# Altium project RK3588底板.PrjPcb (part 2 of 2)

## Sheet 9.PCIE3.SchDoc
size 420 x 297 mm; SheetNumber: 9; SheetTotal: 13
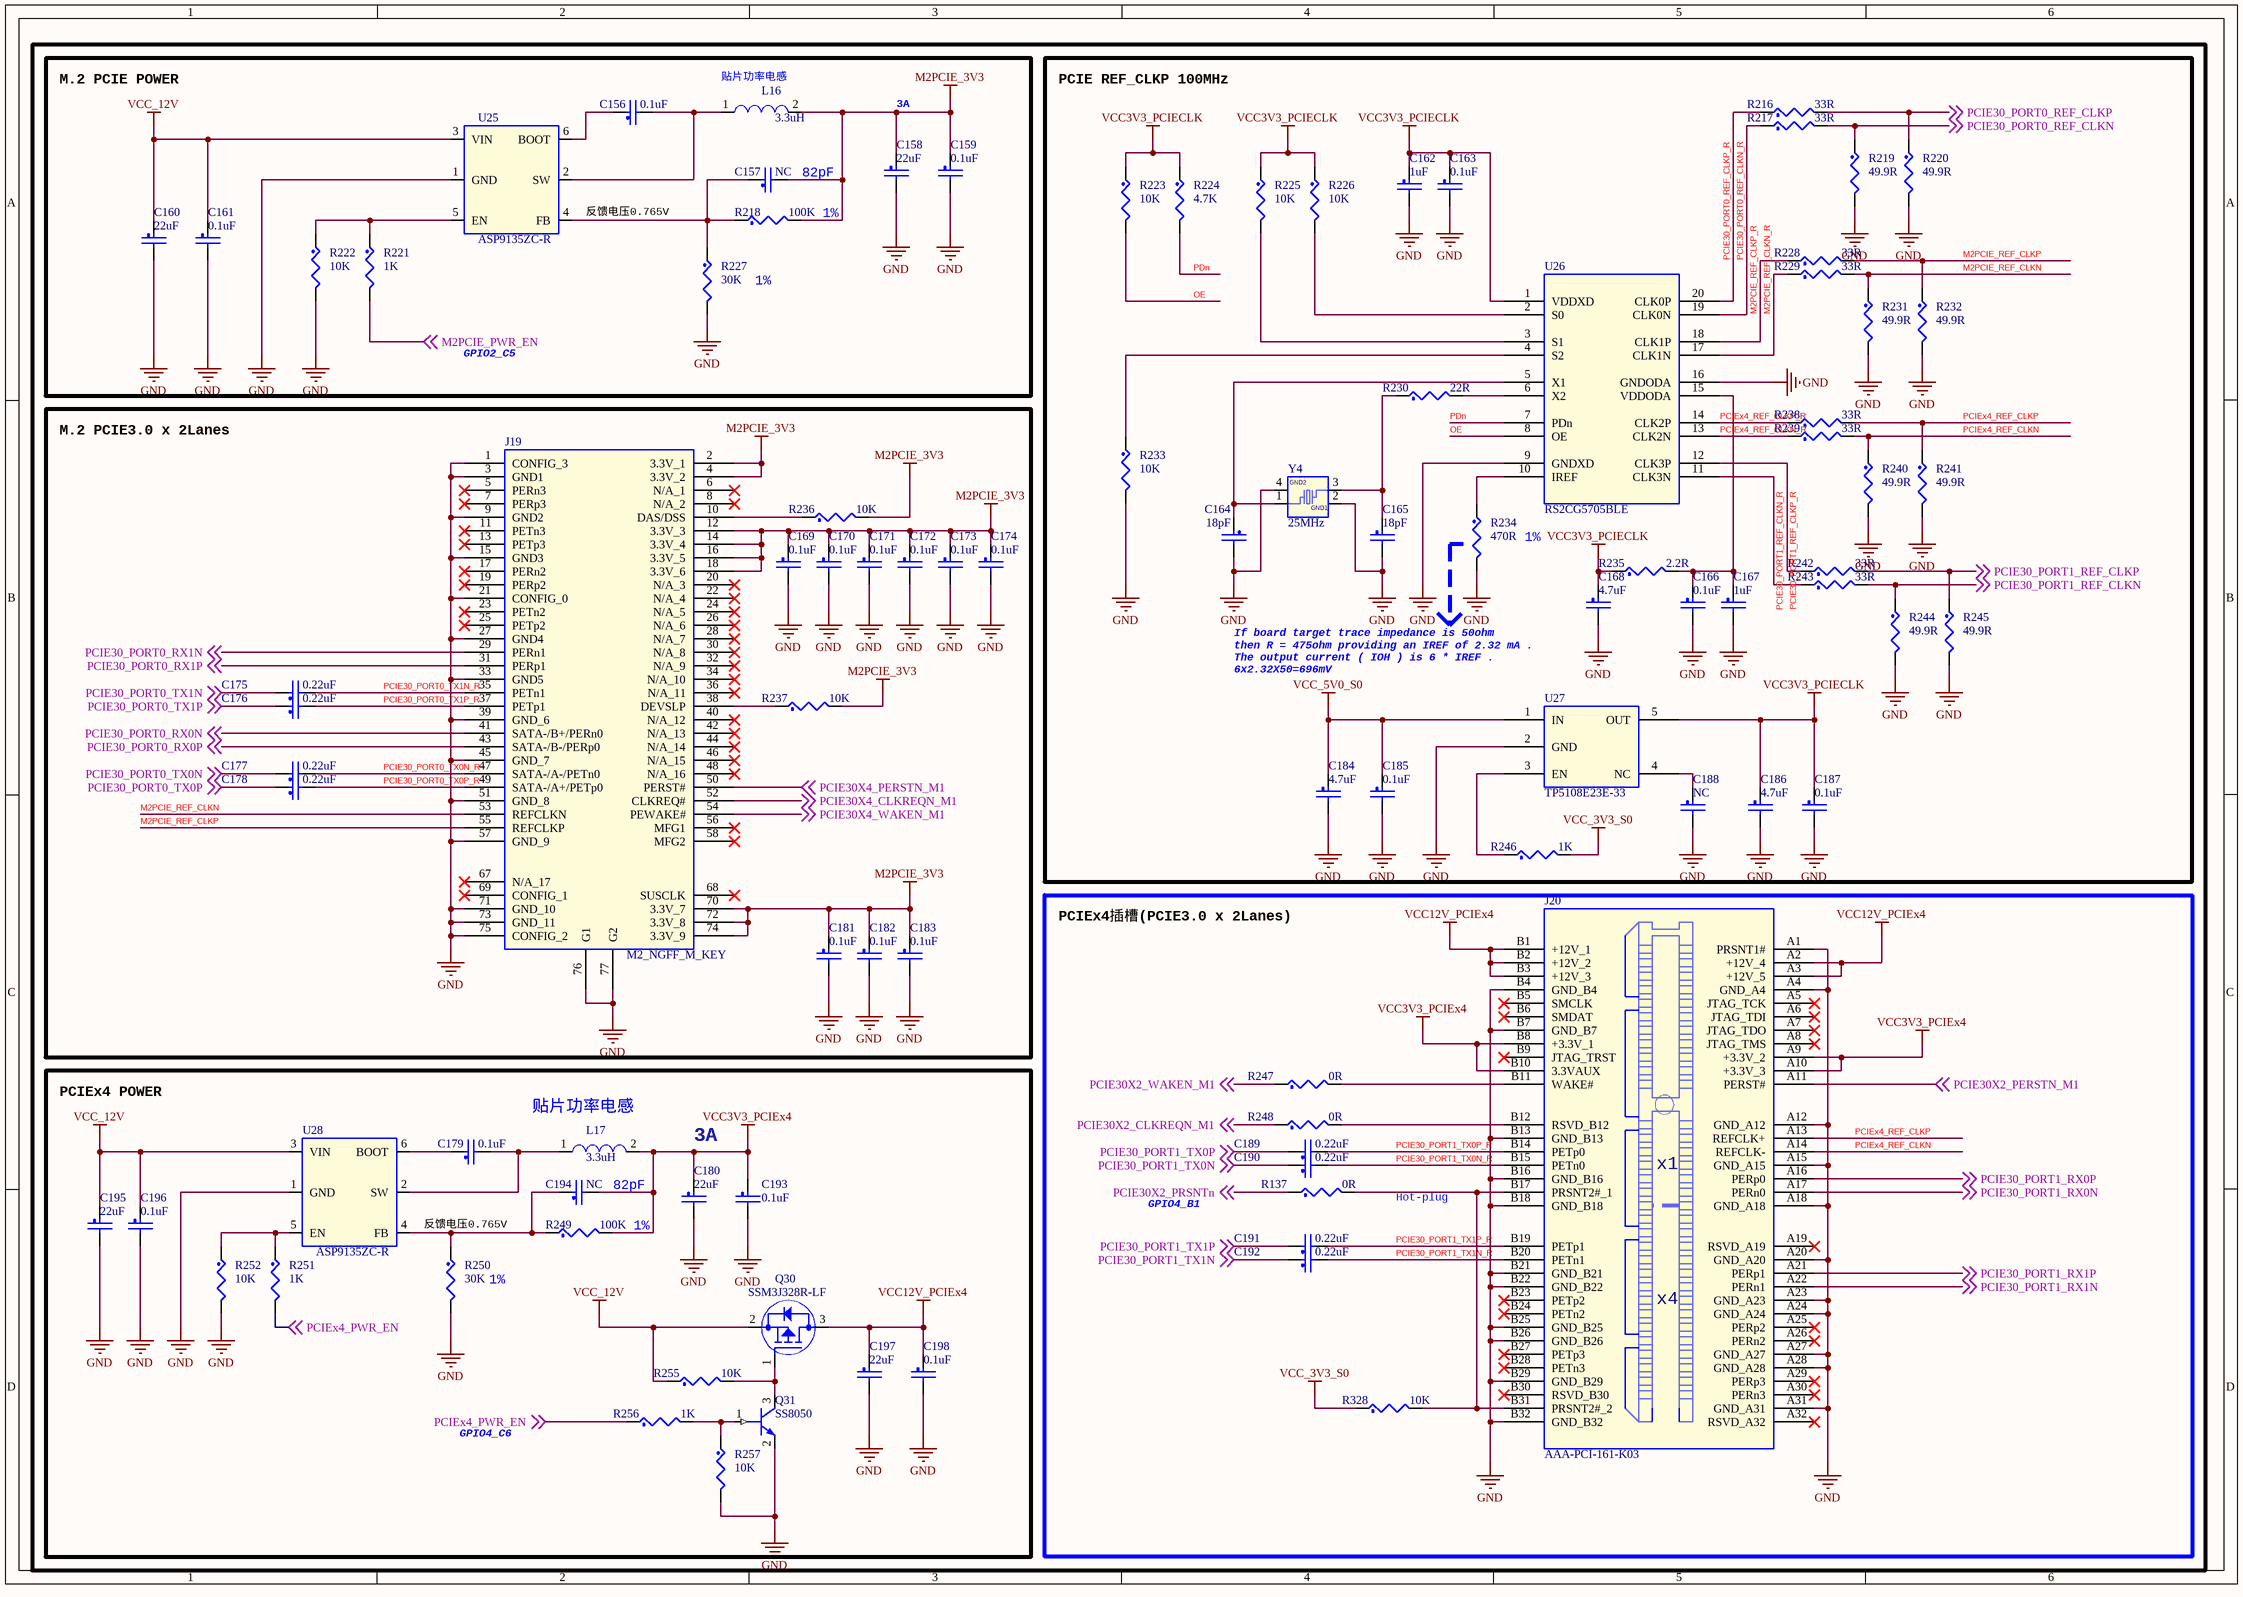
[diagram p8: 9.PCIE3.SchDoc]

### Parts
C156  0.1uF  [C0402]
C157  NC  [C0402]
C158  22uF  [C0603]
C159  0.1uF  [C0402]
C160  22uF  [C0603]
C161  0.1uF  [C0402]
C162  1uF  [C0402]
C163  0.1uF  [C0402]
C164  18pF  [C0402]
C165  18pF  [C0402]
C166  0.1uF  [C0402]
C167  1uF  [C0402]
C168  4.7uF  [C0402]
C169  0.1uF  [C0402]
C170  0.1uF  [C0402]
C171  0.1uF  [C0402]
C172  0.1uF  [C0402]
C173  0.1uF  [C0402]
C174  0.1uF  [C0402]
C175  0.22uF  [C0402]
C176  0.22uF  [C0402]
C177  0.22uF  [C0402]
C178  0.22uF  [C0402]
C179  0.1uF  [C0402]
C180  22uF  [C0603]
C181  0.1uF  [C0402]
C182  0.1uF  [C0402]
C183  0.1uF  [C0402]
C184  4.7uF  [C0402]
C185  0.1uF  [C0402]
C186  4.7uF  [C0402]
C187  0.1uF  [C0402]
C188  NC  [C0402]
C189  0.22uF  [C0402]
C190  0.22uF  [C0402]
C191  0.22uF  [C0402]
C192  0.22uF  [C0402]
C193  0.1uF  [C0402]
C194  NC  [C0402]
C195  22uF  [C0603]
C196  0.1uF  [C0402]
C197  22uF  [C0603]
C198  0.1uF  [C0402]
J19  M2_NGFF_M_KEY  [M2_NGFF_M_KEY]
J20  AAA-PCI-161-K03  [PCIE_64PIN_1R00]
L16  3.3uH  [l4520]
L17  3.3uH  [l4520]
Q30  SSM3J328R-LF  [SOT23]
Q31  SS8050  [SOT23]
R137  0R  [R0402]
R216  33R  [R0402]
R217  33R  [R0402]
R218  100K  [R0402]
R219  49.9R  [R0402]
R220  49.9R  [R0402]
R221  1K  [R0402]
R222  10K  [R0402]
R223  10K  [R0402]
R224  4.7K  [R0402]
R225  10K  [R0402]
R226  10K  [R0402]
R227  30K  [R0402]
R228  33R  [R0402]
R229  33R  [R0402]
R230  22R  [R0402]
R231  49.9R  [R0402]
R232  49.9R  [R0402]
R233  10K  [R0402]
R234  470R  [R0402]
R235  2.2R  [R0402]
R236  10K  [R0402]
R237  10K  [R0402]
R238  33R  [R0402]
R239  33R  [R0402]
R240  49.9R  [R0402]
R241  49.9R  [R0402]
R242  33R  [R0402]
R243  33R  [R0402]
R244  49.9R  [R0402]
R245  49.9R  [R0402]
R246  1K  [R0402]
R247  0R  [R0402]
R248  0R  [R0402]
R249  100K  [R0402]
R250  30K  [R0402]
R251  1K  [R0402]
R252  10K  [R0402]
R255  10K  [R0402]
R256  1K  [R0402]
R257  10K  [R0402]
R328  10K  [R0402]
U25  ASP9135ZC-R  [SOT23_6]
U26  RS2CG5705BLE  [TSSOP20]
U27  TP5108E23E-33  [SOT23-5]
U28  ASP9135ZC-R  [SOT23_6]
Y4  25MHz  [3225]

### Blocks framed on the sheet
M.2 PCIE POWER: C156-C161 L16 R218 R221 R222 R227 U25
PCIE REF_CLKP 100MHz: C162-C168 C184-C188 R216 R217 R219 R220 R223-R226 R228-R235 R238-R246 U26 U27 Y4
M.2 PCIE3.0 x 2Lanes: C169-C178 C181-C183 J19 R236 R237
PCIEx4插槽(PCIE3.0 x 2Lanes): C189-C192 J20 R137 R247 R248 R328
3A: C179 C180 C193-C198 L17 Q30 Q31 R249-R252 R255-R257 U28

### Nets
GND: C158.2 C159.2 C160.2 C161.2 C162.2 C163.2 C164.2 C165.2 C166.2 C167.2 C168.2 C169.2 C170.2 C171.2 C172.2 C173.2 C174.2 C180.2 C181.2 C182.2 C183.2 C184.2 C185.2 C186.2 C187.2 C188.2 C193.2 C195.2 C196.2 C197.2 C198.2 J19.1(CONFIG_3) J19.3(GND1) J19.9(GND2) J19.15(GND3) J19.21(CONFIG_0) J19.27(GND4) J19.33(GND5) J19.39(GND_6) J19.45(GND_7) J19.51(GND_8) J19.57(GND_9) J19.71(GND_10) J19.73(GND_11) J19.75(CONFIG_2) J19.76(G1) J19.77(G2) J20.A1(PRSNT1#) J20.A4(GND_A4) J20.A12(GND_A12) J20.A15(GND_A15) J20.A18(GND_A18) J20.A20(GND_A20) J20.A23(GND_A23) J20.A24(GND_A24) J20.A27(GND_A27) J20.A28(GND_A28) J20.A31(GND_A31) J20.B4(GND_B4) J20.B7(GND_B7) J20.B13(GND_B13) J20.B16(GND_B16) J20.B18(GND_B18) J20.B21(GND_B21) J20.B22(GND_B22) J20.B25(GND_B25) J20.B26(GND_B26) J20.B29(GND_B29) J20.B32(GND_B32) Q31.2(EMITTER) R219.2 R220.2 R222.2 R227.2 R231.2 R232.2 R233.2 R234.2 R240.2 R241.2 R244.2 R245.2 R250.2 R252.2 R257.2 U25.1(GND) U26.9(GNDXD) U26.16(GNDODA) U27.2(GND) U28.1(GND) Y4.2(GND1) Y4.4(GND2)
M2PCIE_3V3: C157.2 C158.1 C159.1 C169.1 C170.1 C171.1 C172.1 C173.1 C174.1 C181.1 C182.1 C183.1 J19.2(3.3V_1) J19.4(3.3V_2) J19.12(3.3V_3) J19.14(3.3V_4) J19.16(3.3V_5) J19.18(3.3V_6) J19.70(3.3V_7) J19.72(3.3V_8) J19.74(3.3V_9) L16.2 R218.2 R236.2 R237.2
VCC3V3_PCIECLK: C162.1 C163.1 C168.1 C186.1 C187.1 R223.1 R224.1 R225.1 R226.1 R235.1 U26.1(VDDXD) U27.5(OUT)
VCC3V3_PCIEx4: C180.1 C193.1 C194.2 J20.A9(+3.3V_2) J20.A10(+3.3V_3) J20.B8(+3.3V_1) J20.B10(3.3VAUX) L17.2 R249.2
VCC12V_PCIEx4: C197.1 C198.1 J20.A2(+12V_4) J20.A3(+12V_5) J20.B1(+12V_1) J20.B2(+12V_2) J20.B3(+12V_3) Q30.3(DRAIN)
VCC_3V3_S0: R246.2 R328.1
VCC_5V0_S0: C184.1 C185.1 U27.1(IN)
VCC_12V: C160.1 C161.1 C195.1 C196.1 Q30.2(SOURCE) R255.1 U25.3(VIN) U28.3(VIN)
M2PCIE_PWR_EN: R221.2 ; off-sheet M2PCIE_PWR_EN  [project net GPIO2_C5]
M2PCIE_REF_CLKN: J19.53(REFCLKN) R229.2 R231.1
M2PCIE_REF_CLKN_R: R229.1 U26.17(CLK1N)
M2PCIE_REF_CLKP: J19.55(REFCLKP) R228.2 R232.1
M2PCIE_REF_CLKP_R: R228.1 U26.18(CLK1P)
OE: R223.2 U26.8(OE)
PCIE30_PORT0_REF_CLKN: R217.2 R219.1 ; off-sheet PCIE30_PORT0_REF_CLKN
PCIE30_PORT0_REF_CLKN_R: R217.1 U26.19(CLK0N)
PCIE30_PORT0_REF_CLKP: R216.2 R220.1 ; off-sheet PCIE30_PORT0_REF_CLKP
PCIE30_PORT0_REF_CLKP_R: R216.1 U26.20(CLK0P)
PCIE30_PORT0_RX0N: J19.41(SATA-/B+/PERn0) ; off-sheet PCIE30_PORT0_RX0N
PCIE30_PORT0_RX0P: J19.43(SATA-/B-/PERp0) ; off-sheet PCIE30_PORT0_RX0P
PCIE30_PORT0_RX1N: J19.29(PERn1) ; off-sheet PCIE30_PORT0_RX1N
PCIE30_PORT0_RX1P: J19.31(PERp1) ; off-sheet PCIE30_PORT0_RX1P
PCIE30_PORT0_TX0N: C177.1 ; off-sheet PCIE30_PORT0_TX0N
PCIE30_PORT0_TX0N_R: C177.2 J19.47(SATA-/A-/PETn0)
PCIE30_PORT0_TX0P: C178.1 ; off-sheet PCIE30_PORT0_TX0P
PCIE30_PORT0_TX0P_R: C178.2 J19.49(SATA-/A+/PETp0)
PCIE30_PORT0_TX1N: C175.1 ; off-sheet PCIE30_PORT0_TX1N
PCIE30_PORT0_TX1N_R: C175.2 J19.35(PETn1)
PCIE30_PORT0_TX1P: C176.1 ; off-sheet PCIE30_PORT0_TX1P
PCIE30_PORT0_TX1P_R: C176.2 J19.37(PETp1)
PCIE30_PORT1_REF_CLKN: R243.2 R244.1 ; off-sheet PCIE30_PORT1_REF_CLKN
PCIE30_PORT1_REF_CLKN_R: R243.1 U26.11(CLK3N)
PCIE30_PORT1_REF_CLKP: R242.2 R245.1 ; off-sheet PCIE30_PORT1_REF_CLKP
PCIE30_PORT1_REF_CLKP_R: R242.1 U26.12(CLK3P)
PCIE30_PORT1_RX0N: J20.A17(PERn0) ; off-sheet PCIE30_PORT1_RX0N
PCIE30_PORT1_RX0P: J20.A16(PERp0) ; off-sheet PCIE30_PORT1_RX0P
PCIE30_PORT1_RX1N: J20.A22(PERn1) ; off-sheet PCIE30_PORT1_RX1N
PCIE30_PORT1_RX1P: J20.A21(PERp1) ; off-sheet PCIE30_PORT1_RX1P
PCIE30_PORT1_TX0N: C190.1 ; off-sheet PCIE30_PORT1_TX0N
PCIE30_PORT1_TX0N_R: C190.2 J20.B15(PETn0)
PCIE30_PORT1_TX0P: C189.1 ; off-sheet PCIE30_PORT1_TX0P
PCIE30_PORT1_TX0P_R: C189.2 J20.B14(PETp0)
PCIE30_PORT1_TX1N: C192.1 ; off-sheet PCIE30_PORT1_TX1N
PCIE30_PORT1_TX1N_R: C192.2 J20.B20(PETn1)
PCIE30_PORT1_TX1P: C191.1 ; off-sheet PCIE30_PORT1_TX1P
PCIE30_PORT1_TX1P_R: C191.2 J20.B19(PETp1)
PCIE30X2_CLKREQN_M1: R248.1 ; off-sheet PCIE30X2_CLKREQN_M1
PCIE30X2_PERSTN_M1: J20.A11(PERST#) ; off-sheet PCIE30X2_PERSTN_M1
PCIE30X2_PRSNTn: R137.1 ; off-sheet PCIE30X2_PRSNTn  [project net GPIO4_B1]
PCIE30X2_WAKEN_M1: R247.1 ; off-sheet PCIE30X2_WAKEN_M1
PCIE30X4_CLKREQN_M1: J19.52(CLKREQ#) ; off-sheet PCIE30X4_CLKREQN_M1
PCIE30X4_PERSTN_M1: J19.50(PERST#) ; off-sheet PCIE30X4_PERSTN_M1
PCIE30X4_WAKEN_M1: J19.54(PEWAKE#) ; off-sheet PCIE30X4_WAKEN_M1
PCIEx4_PWR_EN: R251.2 R256.1 ; off-sheet PCIEx4_PWR_EN  [project net GPIO4_C6]
PCIEx4_REF_CLKN: J20.A14(REFCLK-) R239.2 R240.1
PCIEx4_REF_CLKN_R: R239.1 U26.13(CLK2N)
PCIEx4_REF_CLKP: J20.A13(REFCLK+) R238.2 R241.1
PCIEx4_REF_CLKP_R: R238.1 U26.14(CLK2P)
PDn: R224.2 U26.7(PDn)
NetC156_1: C156.1 U25.6(BOOT)
NetC156_2: C156.2 L16.1 U25.2(SW)
NetC157_1: C157.1 R218.1 R227.1 U25.4(FB)
NetC164_1: C164.1 U26.5(X1) Y4.1
NetC165_1: C165.1 R230.1 Y4.3
NetC166_1: C166.1 C167.1 R235.2 U26.15(VDDODA)
NetC179_1: C179.1 U28.6(BOOT)
NetC179_2: C179.2 L17.1 U28.2(SW)
NetC188_1: C188.1 U27.4(NC)
NetC194_1: C194.1 R249.1 R250.1 U28.4(FB)
NetJ19_10: J19.10(DAS/DSS) R236.1
NetJ19_38: J19.38(DEVSLP) R237.1
NetJ20_B11: J20.B11(WAKE#) R247.2
NetJ20_B12: J20.B12(RSVD_B12) R248.2
NetJ20_B17: J20.B17(PRSNT2#_1) J20.B31(PRSNT2#_2) R137.2 R328.2
NetQ30_1: Q30.1(GATE) Q31.3(COLLECTOR) R255.2
NetQ31_1: Q31.1(BASE) R256.2 R257.1
NetR221_1: R221.1 R222.1 U25.5(EN)
NetR225_2: R225.2 U26.3(S1)
NetR226_2: R226.2 U26.2(S0)
NetR230_2: R230.2 U26.6(X2)
NetR233_1: R233.1 U26.4(S2)
NetR234_1: R234.1 U26.10(IREF)
NetR246_1: R246.1 U27.3(EN)
NetR251_1: R251.1 R252.1 U28.5(EN)

Not connected (* = marked no-connect by the designer): J19 5(PERn3)* 6(N/A_1)* 7(PERp3)* 8(N/A_2)* 11(PETn3)* 13(PETp3)* 17(PERn2)* 19(PERp2)* 20(N/A_3)* 22(N/A_4)* 23(PETn2)* 24(N/A_5)* 25(PETp2)* 26(N/A_6)* 28(N/A_7)* 30(N/A_8)* 32(N/A_9)* 34(N/A_10)* 36(N/A_11)* 40(N/A_12)* 42(N/A_13)* 44(N/A_14)* 46(N/A_15)* 48(N/A_16)* 56(MFG1)* 58(MFG2)* 67(N/A_17)* 68(SUSCLK)* 69(CONFIG_1)*; J20 A5(JTAG_TCK)* A6(JTAG_TDI)* A7(JTAG_TDO)* A8(JTAG_TMS)* A19(RSVD_A19)* A25(PERp2)* A26(PERn2)* A29(PERp3)* A30(PERn3)* A32(RSVD_A32)* B5(SMCLK)* B6(SMDAT)* B9(JTAG_TRST)* B23(PETp2)* B24(PETn2)* B27(PETp3)* B28(PETn3)* B30(RSVD_B30)*

### Notes on the sheet
- (near L16) 贴片功率电感
- 3A
- 82pF
- (near U25) 反馈电压0.765V
- 1%
- GPIO2_C5
- If board target trace impedance is 50ohm
  then R = 475ohm providing an IREF of 2.32 mA .
  The output current ( IOH ) is 6 * IREF .
  6x2.32X50=696mV
- PCIEx4 POWER
- (near L17) 贴片功率电感
- GPIO4_B1
- Hot-plug
- 反馈电压0.765V
- (near R250) 1%
- GPIO4_C6
- (in symbol PCIEX4_64P) x1; x4

### Library data of the parts
C156-C198 = CAP_NP
J20 = PCIEX4_64P
L16 L17 = IND
Q30 = MOSFET_P
Q31 = NPN
R137 R216-R252 R255-R257 R328 = RES
U25 U28 = TP6327GS6
U26 = PI6C557-05BLE
U27 = LDO_PT5108
Y4 = CRYSTAL_4P

## Sheet 10.PCIE2.SchDoc
size 297 x 209 mm; SheetNumber: 10; SheetTotal: 13
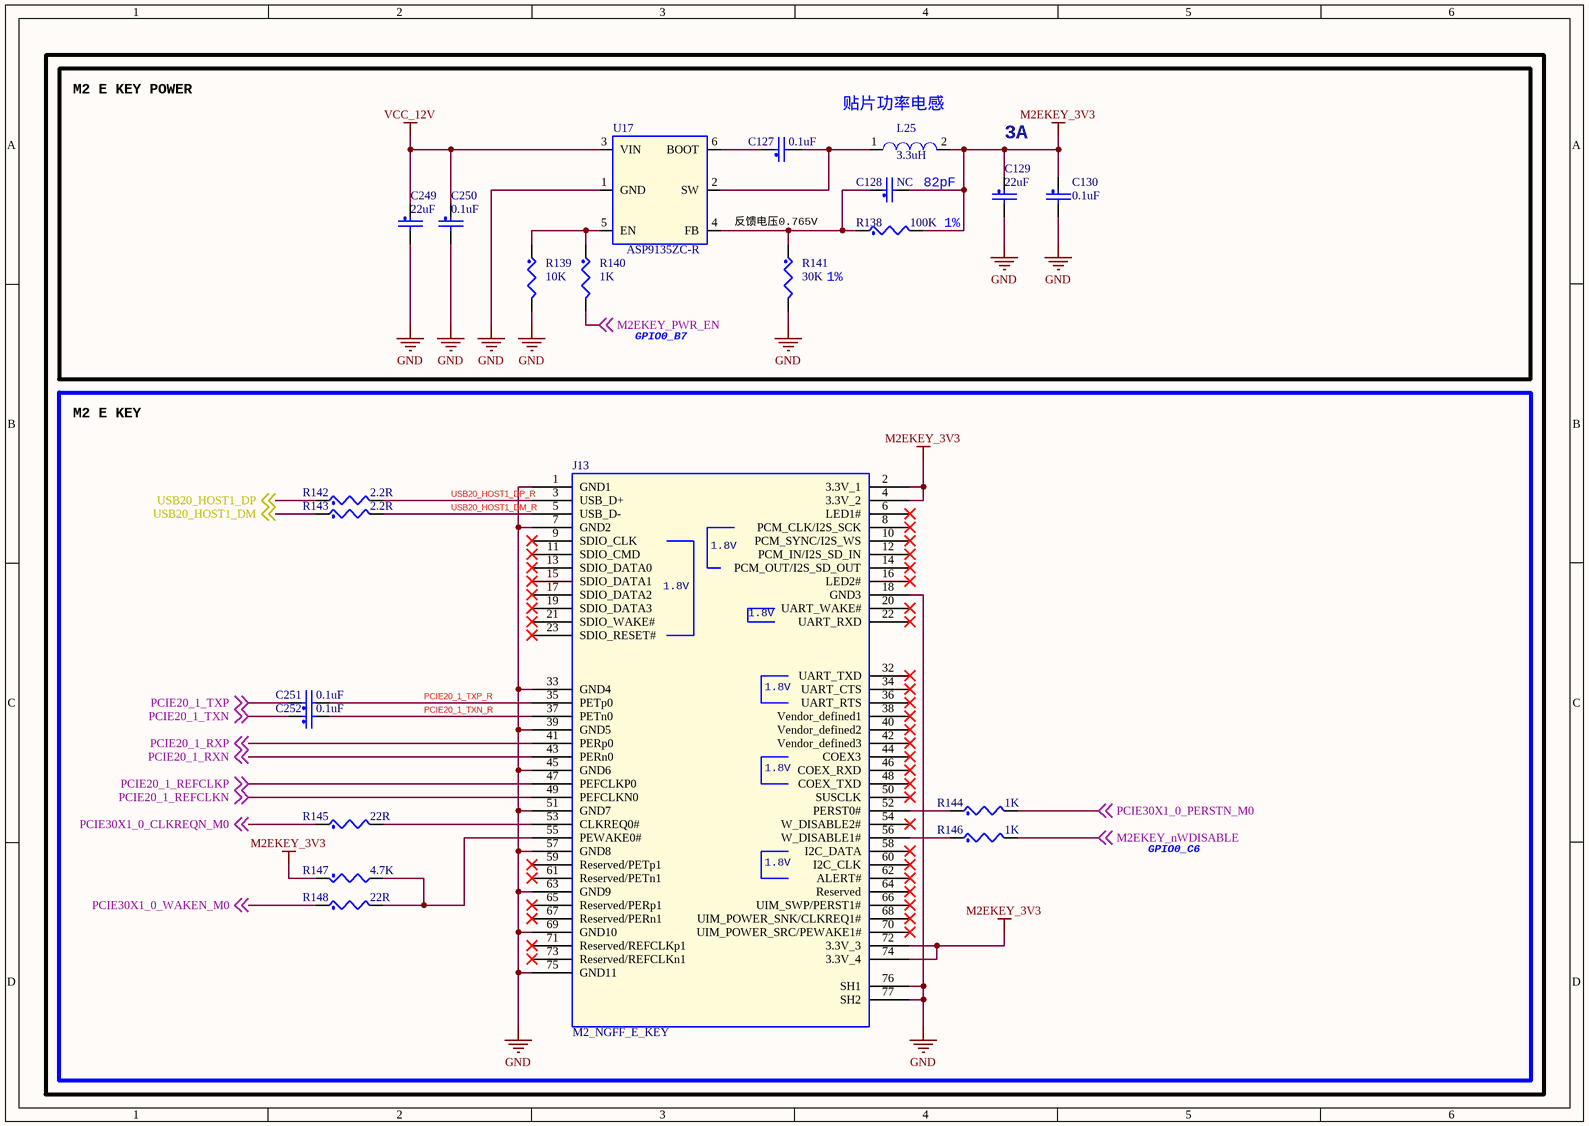
[diagram p9: 10.PCIE2.SchDoc]

### Parts
C127  0.1uF  [C0402]
C128  NC  [C0402]
C129  22uF  [C0603]
C130  0.1uF  [C0402]
C249  22uF  [C0603]
C250  0.1uF  [C0402]
C251  0.1uF  [C0402]
C252  0.1uF  [C0402]
J13  M2_NGFF_E_KEY  [M2_NGFF_E_KEY]
L25  3.3uH  [l4520]
R138  100K  [R0402]
R139  10K  [R0402]
R140  1K  [R0402]
R141  30K  [R0402]
R142  2.2R  [R0402]
R143  2.2R  [R0402]
R144  1K  [R0402]
R145  22R  [R0402]
R146  1K  [R0402]
R147  4.7K  [R0402]
R148  22R  [R0402]
U17  ASP9135ZC-R  [SOT23_6]

### Blocks framed on the sheet
3A: C127-C130 C249 C250 L25 R138-R141 U17
M2 E KEY: C251 C252 J13 R142-R148

### Nets
GND: C129.2 C130.2 C249.2 C250.2 J13.1(GND1) J13.7(GND2) J13.18(GND3) J13.33(GND4) J13.39(GND5) J13.45(GND6) J13.51(GND7) J13.57(GND8) J13.63(GND9) J13.69(GND10) J13.75(GND11) J13.76(SH1) J13.77(SH2) R139.2 R141.2 U17.1(GND)
M2EKEY_3V3: C128.2 C129.1 C130.1 J13.2(3.3V_1) J13.4(3.3V_2) J13.72(3.3V_3) J13.74(3.3V_4) L25.2 R138.2 R147.1
VCC_12V: C249.1 C250.1 U17.3(VIN)
M2EKEY_nWDISABLE: R146.2 ; off-sheet M2EKEY_nWDISABLE  [project net GPIO0_C6]
M2EKEY_PWR_EN: R140.2 ; off-sheet M2EKEY_PWR_EN  [project net GPIO0_B7]
PCIE20_1_REFCLKN: J13.49(PEFCLKN0) ; off-sheet PCIE20_1_REFCLKN
PCIE20_1_REFCLKP: J13.47(PEFCLKP0) ; off-sheet PCIE20_1_REFCLKP
PCIE20_1_RXN: J13.43(PERn0) ; off-sheet PCIE20_1_RXN
PCIE20_1_RXP: J13.41(PERp0) ; off-sheet PCIE20_1_RXP
PCIE20_1_TXN: C252.1 ; off-sheet PCIE20_1_TXN
PCIE20_1_TXN_R: C252.2 J13.37(PETn0)
PCIE20_1_TXP: C251.1 ; off-sheet PCIE20_1_TXP
PCIE20_1_TXP_R: C251.2 J13.35(PETp0)
PCIE30X1_0_CLKREQN_M0: R145.1 ; off-sheet PCIE30X1_0_CLKREQN_M0
PCIE30X1_0_PERSTN_M0: R144.2 ; off-sheet PCIE30X1_0_PERSTN_M0
PCIE30X1_0_WAKEN_M0: R148.1 ; off-sheet PCIE30X1_0_WAKEN_M0
USB20_HOST1_DM: R143.1 ; off-sheet USB20_HOST1_DM
USB20_HOST1_DM_R: J13.5(USB_D-) R143.2
USB20_HOST1_DP: R142.1 ; off-sheet USB20_HOST1_DP
USB20_HOST1_DP_R: J13.3(USB_D+) R142.2
NetC127_1: C127.1 U17.6(BOOT)
NetC127_2: C127.2 L25.1 U17.2(SW)
NetC128_1: C128.1 R138.1 R141.1 U17.4(FB)
NetJ13_52: J13.52(PERST0#) R144.1
NetJ13_53: J13.53(CLKREQ0#) R145.2
NetJ13_55: J13.55(PEWAKE0#) R147.2 R148.2
NetJ13_56: J13.56(W_DISABLE1#) R146.1
NetR139_1: R139.1 R140.1 U17.5(EN)

Not connected (* = marked no-connect by the designer): J13 6(LED1#)* 8(PCM_CLK/I2S_SCK)* 9(SDIO_CLK)* 10(PCM_SYNC/I2S_WS)* 11(SDIO_CMD)* 12(PCM_IN/I2S_SD_IN)* 13(SDIO_DATA0)* 14(PCM_OUT/I2S_SD_OUT)* 15(SDIO_DATA1)* 16(LED2#)* 17(SDIO_DATA2)* 19(SDIO_DATA3)* 20(UART_WAKE#)* 21(SDIO_WAKE#)* 22(UART_RXD)* 23(SDIO_RESET#)* 32(UART_TXD)* 34(UART_CTS)* 36(UART_RTS)* 38(Vendor_defined1)* 40(Vendor_defined2)* 42(Vendor_defined3)* 44(COEX3)* 46(COEX_RXD)* 48(COEX_TXD)* 50(SUSCLK)* 54(W_DISABLE2#)* 58(I2C_DATA)* 59(Reserved/PETp1)* 60(I2C_CLK)* 61(Reserved/PETn1)* 62(ALERT#)* 64(Reserved)* 65(Reserved/PERp1)* 66(UIM_SWP/PERST1#)* 67(Reserved/PERn1)* 68(UIM_POWER_SNK/CLKREQ1#)* 70(UIM_POWER_SRC/PEWAKE1#)* 71(Reserved/REFCLKp1)* 73(Reserved/REFCLKn1)*

### Notes on the sheet
- M2 E KEY POWER
- (near L25) 贴片功率电感
- 82pF
- 反馈电压0.765V
- 1%
- GPIO0_B7
- GPIO0_C6
- (in symbol M2_NGFF_E_KEY) 1.8V

### Library data of the parts
C127-C130 C249-C252 = CAP_NP
L25 = IND
R138-R148 = RES
U17 = TP6327GS6

## Sheet 11.MIPI DSI_CSI.SchDoc
size 297 x 209 mm; SheetNumber: 11; SheetTotal: 13
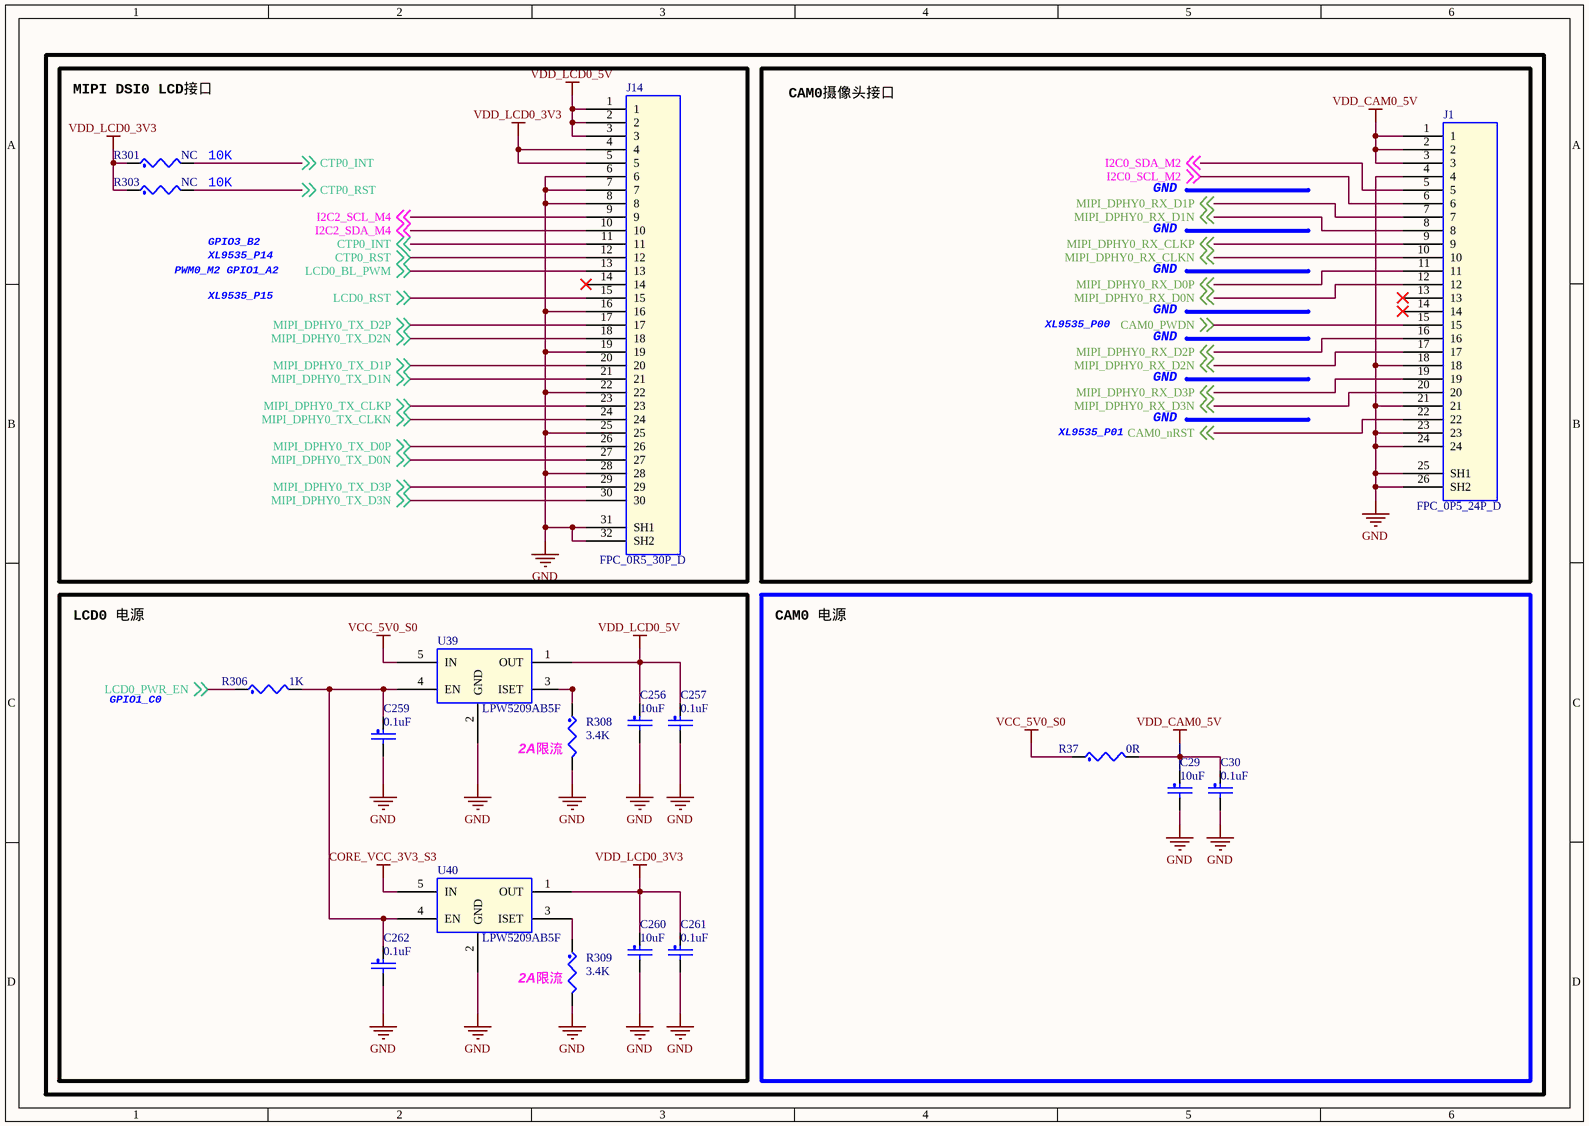
[diagram p10: 11.MIPI DSI_CSI.SchDoc]

### Parts
C29  10uF  [C0402]
C30  0.1uF  [C0402]
C256  10uF  [C0402]
C257  0.1uF  [C0402]
C259  0.1uF  [C0402]
C260  10uF  [C0402]
C261  0.1uF  [C0402]
C262  0.1uF  [C0402]
J1  FPC_0P5_24P_D  [fpc_24p_0p5]
J14  FPC_0R5_30P_D  [FPC-30P-0P5]
R37  0R  [R0402]
R301  NC  [R0402]
R303  NC  [R0402]
R306  1K  [R0402]
R308  3.4K  [R0402]
R309  3.4K  [R0402]
U39  LPW5209AB5F  [SOT23-5]
U40  LPW5209AB5F  [SOT23-5]

### Blocks framed on the sheet
MIPI DSI0 LCD接口: J14 R301 R303
CAM0摄像头接口: J1
LCD0 电源: C256 C257 C259-C262 R306 R308 R309 U39 U40
CAM0 电源: C29 C30 R37

### Nets
CORE_VCC_3V3_S3: U40.5(IN)
GND: C29.2 C30.2 C256.2 C257.2 C259.2 C260.2 C261.2 C262.2 J1.4 J1.18 J1.21 J1.23 J1.24 J1.25(SH1) J1.26(SH2) J14.6 J14.7 J14.8 J14.16 J14.19 J14.22 J14.25 J14.28 J14.31(SH1) J14.32(SH2) R308.2 R309.2 U39.2(GND) U40.2(GND)
VCC_5V0_S0: R37.1 U39.5(IN)
VDD_CAM0_5V: C29.1 C30.1 J1.1 J1.2 J1.3 R37.2
VDD_LCD0_3V3: C260.1 C261.1 J14.4 J14.5 R301.1 R303.1 U40.1(OUT)
VDD_LCD0_5V: C256.1 C257.1 J14.1 J14.2 J14.3 U39.1(OUT)
CAM0_nRST: J1.22 ; off-sheet CAM0_nRST
CAM0_PWDN: J1.15 ; off-sheet CAM0_PWDN
CTP0_INT: J14.11 R301.2 ; off-sheet CTP0_INT
CTP0_RST: J14.12 R303.2 ; off-sheet CTP0_RST
I2C0_SCL_M2: J1.6 ; off-sheet I2C0_SCL_M2
I2C0_SDA_M2: J1.5 ; off-sheet I2C0_SDA_M2
I2C2_SCL_M4: J14.9 ; off-sheet I2C2_SCL_M4
I2C2_SDA_M4: J14.10 ; off-sheet I2C2_SDA_M4
LCD0_BL_PWM: J14.13 ; off-sheet LCD0_BL_PWM  [project net GPIO1_A2]
LCD0_PWR_EN: R306.1 ; off-sheet LCD0_PWR_EN  [project net GPIO1_C0]
LCD0_RST: J14.15 ; off-sheet LCD0_RST
MIPI_DPHY0_RX_CLKN: J1.10 ; off-sheet MIPI_DPHY0_RX_CLKN
MIPI_DPHY0_RX_CLKP: J1.9 ; off-sheet MIPI_DPHY0_RX_CLKP
MIPI_DPHY0_RX_D0N: J1.12 ; off-sheet MIPI_DPHY0_RX_D0N
MIPI_DPHY0_RX_D0P: J1.11 ; off-sheet MIPI_DPHY0_RX_D0P
MIPI_DPHY0_RX_D1N: J1.8 ; off-sheet MIPI_DPHY0_RX_D1N
MIPI_DPHY0_RX_D1P: J1.7 ; off-sheet MIPI_DPHY0_RX_D1P
MIPI_DPHY0_RX_D2N: J1.17 ; off-sheet MIPI_DPHY0_RX_D2N
MIPI_DPHY0_RX_D2P: J1.16 ; off-sheet MIPI_DPHY0_RX_D2P
MIPI_DPHY0_RX_D3N: J1.20 ; off-sheet MIPI_DPHY0_RX_D3N
MIPI_DPHY0_RX_D3P: J1.19 ; off-sheet MIPI_DPHY0_RX_D3P
MIPI_DPHY0_TX_CLKN: J14.24 ; off-sheet MIPI_DPHY0_TX_CLKN
MIPI_DPHY0_TX_CLKP: J14.23 ; off-sheet MIPI_DPHY0_TX_CLKP
MIPI_DPHY0_TX_D0N: J14.27 ; off-sheet MIPI_DPHY0_TX_D0N
MIPI_DPHY0_TX_D0P: J14.26 ; off-sheet MIPI_DPHY0_TX_D0P
MIPI_DPHY0_TX_D1N: J14.21 ; off-sheet MIPI_DPHY0_TX_D1N
MIPI_DPHY0_TX_D1P: J14.20 ; off-sheet MIPI_DPHY0_TX_D1P
MIPI_DPHY0_TX_D2N: J14.18 ; off-sheet MIPI_DPHY0_TX_D2N
MIPI_DPHY0_TX_D2P: J14.17 ; off-sheet MIPI_DPHY0_TX_D2P
MIPI_DPHY0_TX_D3N: J14.30 ; off-sheet MIPI_DPHY0_TX_D3N
MIPI_DPHY0_TX_D3P: J14.29 ; off-sheet MIPI_DPHY0_TX_D3P
NetC259_1: C259.1 C262.1 R306.2 U39.4(EN) U40.4(EN)
NetR308_1: R308.1 U39.3(ISET)
NetR309_1: R309.1 U40.3(ISET)

Not connected (* = marked no-connect by the designer): J1 13* 14*; J14 14*

### Notes on the sheet
- 10K
- GND
- GPIO3_B2
- XL9535_P14
- PWM0_M2 GPIO1_A2
- XL9535_P15
- XL9535_P00
- XL9535_P01
- GPIO1_C0
- 2A限流

### Library data of the parts
C29 C30 C256 C257 C259-C262 = CAP_NP
J1 = FPC-24P
J14 = FPC-30P
R37 R301 R303 R306 R308 R309 = RES

## Sheet 12.SATA接口.SchDoc
size A4; SheetNumber: 12; SheetTotal: 13
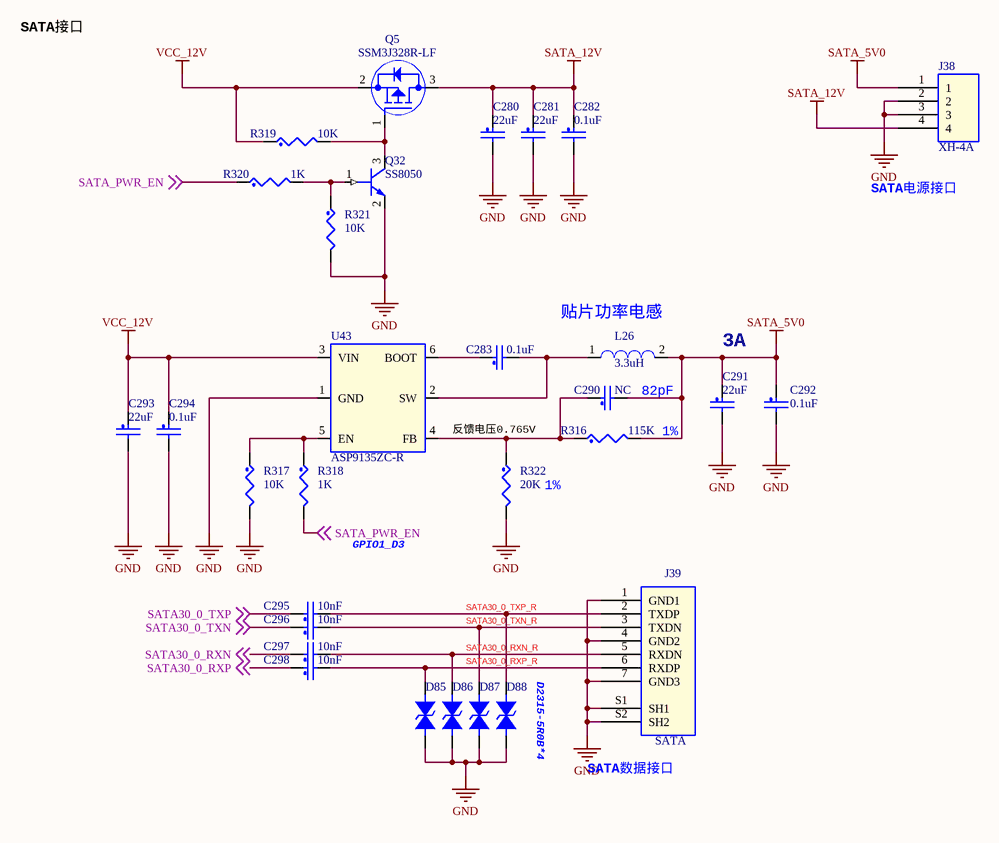
[diagram p11: 12.SATA接口.SchDoc]

### Parts
C280  22uF  [C0805]
C281  22uF  [C0805]
C282  0.1uF  [C0402]
C283  0.1uF  [C0402]
C290  NC  [C0402]
C291  22uF  [C0603]
C292  0.1uF  [C0402]
C293  22uF  [C0603]
C294  0.1uF  [C0402]
C295  10nF  [C0402]
C296  10nF  [C0402]
C297  10nF  [C0402]
C298  10nF  [C0402]
D85  D2315-5R0B  [esd0402]  (value not drawn)
D86  D2315-5R0B  [esd0402]  (value not drawn)
D87  D2315-5R0B  [esd0402]  (value not drawn)
D88  D2315-5R0B  [esd0402]  (value not drawn)
J38  XH-4A  [XH2p54-4p]
J39  SATA  [ssata_v]
L26  3.3uH  [l4520]
Q5  SSM3J328R-LF  [SOT23]
Q32  SS8050  [SOT23]
R316  115K  [R0402]
R317  10K  [R0402]
R318  1K  [R0402]
R319  10K  [R0402]
R320  1K  [R0402]
R321  10K  [R0402]
R322  20K  [R0402]
U43  ASP9135ZC-R  [SOT23_6]

### Nets
GND: C280.2 C281.2 C282.2 C291.2 C292.2 C293.2 C294.2 D85.1 D86.1 D87.1 D88.1 J38.2 J38.3 J39.1(GND1) J39.4(GND2) J39.7(GND3) J39.S1(SH1) J39.S2(SH2) Q32.2(EMITTER) R317.2 R321.2 R322.2 U43.1(GND)
SATA_5V0: C290.2 C291.1 C292.1 J38.1 L26.2 R316.2
SATA_12V: C280.1 C281.1 C282.1 J38.4 Q5.3(DRAIN)
VCC_12V: C293.1 C294.1 Q5.2(SOURCE) R319.1 U43.3(VIN)
SATA30_0_RXN: C297.1 ; off-sheet SATA30_0_RXN  [project net PCIE20_0_RXN]
SATA30_0_RXN_R: C297.2 D86.2 J39.5(RXDN)
SATA30_0_RXP: C298.1 ; off-sheet SATA30_0_RXP  [project net PCIE20_0_RXP]
SATA30_0_RXP_R: C298.2 D85.2 J39.6(RXDP)
SATA30_0_TXN: C296.1 ; off-sheet SATA30_0_TXN  [project net PCIE20_0_TXN]
SATA30_0_TXN_R: C296.2 D87.2 J39.3(TXDN)
SATA30_0_TXP: C295.1 ; off-sheet SATA30_0_TXP  [project net PCIE20_0_TXP]
SATA30_0_TXP_R: C295.2 D88.2 J39.2(TXDP)
SATA_PWR_EN: R318.2 R320.1 ; off-sheet SATA_PWR_EN  [project net GPIO1_D3]
NetC283_1: C283.1 U43.6(BOOT)
NetC283_2: C283.2 L26.1 U43.2(SW)
NetC290_1: C290.1 R316.1 R322.1 U43.4(FB)
NetQ5_1: Q5.1(GATE) Q32.3(COLLECTOR) R319.2
NetQ32_1: Q32.1(BASE) R320.2 R321.1
NetR317_1: R317.1 R318.1 U43.5(EN)

### Notes on the sheet
- SATA接口
- SATA电源接口
- (near L26) 贴片功率电感
- 3A
- 反馈电压0.765V
- 82pF
- 1%
- GPIO1_D3
- (near D88) D2315-5R0B*4
- (near J39) SATA数据接口

### Library data of the parts
C280-C283 C290-C298 = CAP_NP
D85-D88 = DIODE BI-DIR TRIG
J38 = 1X4PIN
L26 = IND
Q5 = MOSFET_P
Q32 = NPN
R316-R322 = RES
U43 = TP6327GS6

## Sheet 13.GPIO扩展接口.SchDoc
size A4; SheetNumber: 13; SheetTotal: 13
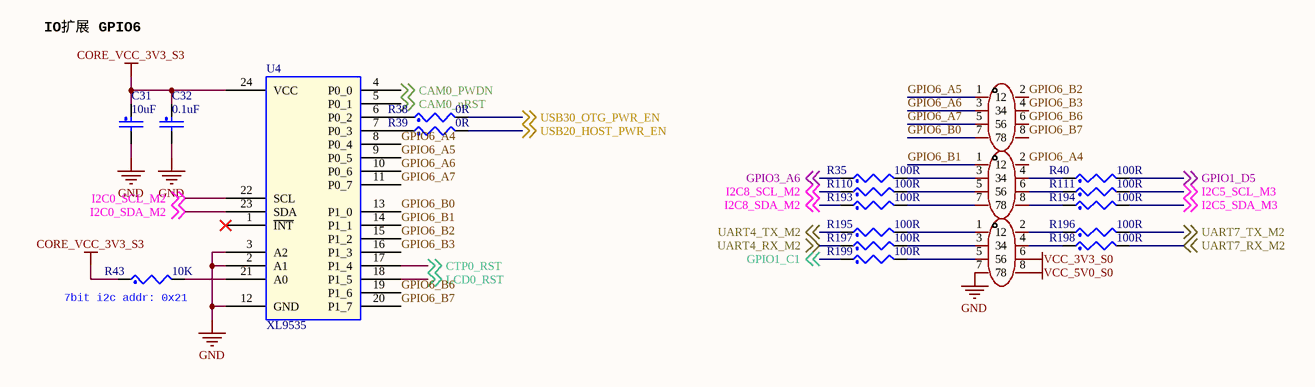
[diagram p12: 13.GPIO扩展接口.SchDoc]

### Parts
C31  10uF  [C0402]
C32  0.1uF  [C0402]
H1  HX PZ2.0-2x4P WT  [HDR-SMD_HX-PZ2.0-2X4P-WT]  (value not drawn)
H2  HX PZ2.0-2x4P WT  [HDR-SMD_HX-PZ2.0-2X4P-WT]  (value not drawn)
H3  HX PZ2.0-2x4P WT  [HDR-SMD_HX-PZ2.0-2X4P-WT]  (value not drawn)
R35  100R  [R0402]
R38  0R  [R0402]
R39  0R  [R0402]
R40  100R  [R0402]
R43  10K  [R0402]
R110  100R  [R0402]
R111  100R  [R0402]
R193  100R  [R0402]
R194  100R  [R0402]
R195  100R  [R0402]
R196  100R  [R0402]
R197  100R  [R0402]
R198  100R  [R0402]
R199  100R  [R0402]
U4  XL9535  [TSSOP24-0R65-7R80X4R40]

### Nets
CORE_VCC_3V3_S3: C31.1 C32.1 R43.1 U4.24(VCC)
GND: C31.2 C32.2 H3.7 U4.2(A1) U4.3(A2) U4.12(GND)
VCC_3V3_S0: H3.6
VCC_5V0_S0: H3.8
CAM0_nRST: U4.5(P0_1) ; off-sheet CAM0_nRST
CAM0_PWDN: U4.4(P0_0) ; off-sheet CAM0_PWDN
CTP0_RST: U4.17(P1_4) ; off-sheet CTP0_RST
GPIO1_C1: R199.1 ; off-sheet GPIO1_C1
GPIO1_D5: R40.2 ; off-sheet GPIO1_D5
GPIO3_A6: R35.1 ; off-sheet GPIO3_A6
GPIO6_A4: H2.2 U4.8(P0_4)
GPIO6_A5: H1.1 U4.9(P0_5)
GPIO6_A6: H1.3 U4.10(P0_6)
GPIO6_A7: H1.5 U4.11(P0_7)
GPIO6_B0: H1.7 U4.13(P1_0)
GPIO6_B1: H2.1 U4.14(P1_1)
GPIO6_B2: H1.2 U4.15(P1_2)
GPIO6_B3: H1.4 U4.16(P1_3)
GPIO6_B6: H1.6 U4.19(P1_6)
GPIO6_B7: H1.8 U4.20(P1_7)
I2C0_SCL_M2: U4.22(SCL) ; off-sheet I2C0_SCL_M2
I2C0_SDA_M2: U4.23(SDA) ; off-sheet I2C0_SDA_M2
I2C5_SCL_M3: R111.2 ; off-sheet I2C5_SCL_M3
I2C5_SDA_M3: R194.2 ; off-sheet I2C5_SDA_M3
I2C8_SCL_M2: R110.1 ; off-sheet I2C8_SCL_M2
I2C8_SDA_M2: R193.1 ; off-sheet I2C8_SDA_M2
LCD0_RST: U4.18(P1_5) ; off-sheet LCD0_RST
UART4_RX_M2: R197.1 ; off-sheet UART4_RX_M2
UART4_TX_M2: R195.1 ; off-sheet UART4_TX_M2
UART7_RX_M2: R198.2 ; off-sheet UART7_RX_M2
UART7_TX_M2: R196.2 ; off-sheet UART7_TX_M2
USB20_HOST_PWR_EN: R39.2 ; off-sheet USB20_HOST_PWR_EN
USB30_OTG_PWR_EN: R38.2 ; off-sheet USB30_OTG_PWR_EN
NetH2_3: H2.3 R35.2
NetH2_4: H2.4 R40.1
NetH2_5: H2.5 R110.2
NetH2_6: H2.6 R111.1
NetH2_7: H2.7 R193.2
NetH2_8: H2.8 R194.1
NetH3_1: H3.1 R195.2
NetH3_2: H3.2 R196.1
NetH3_3: H3.3 R197.2
NetH3_4: H3.4 R198.1
NetH3_5: H3.5 R199.2
NetR38_1: R38.1 U4.6(P0_2)
NetR39_1: R39.1 U4.7(P0_3)
NetR43_2: R43.2 U4.21(A0)

Not connected (* = marked no-connect by the designer): U4 1(~{INT})*

### Notes on the sheet
- IO扩展 GPIO6
- (near R43) 7bit i2c addr: 0x21

### Library data of the parts
C31 C32 = CAP_NP
R35 R38-R40 R43 R110 R111 R193-R199 = RES

## Nets that join several sheets
CORE_VCC_1V8_S0: 1.BTB (BTB_1.12 BTB_1.89), 2.电源 (R273.2), 4.以太网_eth1 (R381.2), 6.音频_FAN_ADC_LED (L4.1), 8.HDMI2 (6 pins)
CORE_VCC_1V8_S3: 1.BTB (BTB_1.11 BTB_1.90), 3.DEBUG_SD卡_RTC_按键 (R3.1 R276.1 R284.1), 6.音频_FAN_ADC_LED (R119.1)
CORE_VCC_3V3_S0: 1.BTB (BTB_1.9 BTB_1.92), 5.USB3 (R77.1), 6.音频_FAN_ADC_LED (L5.1)
CORE_VCC_3V3_S3: 1.BTB (BTB_1.8 BTB_1.93), 3.DEBUG_SD卡_RTC_按键 (6 pins), 5.USB3 (C81.1 R87.1 U5.3 U5.4), 11.MIPI DSI_CSI (U40.5), 13.GPIO扩展接口 (C31.1 C32.1 R43.1 U4.24)
CORE_VCCA_1V8_S0: 1.BTB (BTB_1.10 BTB_1.91 R20.2 R21.2), 6.音频_FAN_ADC_LED (L14.1)
GND: 1.BTB (111 pins), 2.电源 (42 pins), 3.DEBUG_SD卡_RTC_按键 (51 pins), 4.以太网_eth1 (34 pins), 5.USB3 (53 pins), 6.音频_FAN_ADC_LED (63 pins), 7.HDMI2 (29 pins), 8.HDMI2 (29 pins), 9.PCIE3 (92 pins), 10.PCIE2 (20 pins), 11.MIPI DSI_CSI (29 pins), 12.SATA接口 (23 pins), 13.GPIO扩展接口 (6 pins)
VCC4V0_SYS: 1.BTB (12 pins), 2.电源 (10 pins)
VCC5V0_USB_S0: 2.电源 (5 pins), 5.USB3 (7 pins)
VCC_3V3_S0: 1.BTB (8 pins), 2.电源 (7 pins), 3.DEBUG_SD卡_RTC_按键 (C35.2 C36.2 U18.7 U18.10), 4.以太网_eth1 (R382.2 R383.2), 5.USB3 (R33.1 R34.1), 6.音频_FAN_ADC_LED (L15.1 R128.1), 7.HDMI2 (7 pins), 8.HDMI2 (D49.2 R178.1 R179.1), 9.PCIE3 (R246.2 R328.1), 13.GPIO扩展接口 (H3.6)
VCC_5V0_S0: 2.电源 (5 pins), 6.音频_FAN_ADC_LED (R127.1 R342.1 R348.1), 7.HDMI2 (D26.2 Q14.1), 8.HDMI2 (D33.2), 9.PCIE3 (C184.1 C185.1 U27.1), 11.MIPI DSI_CSI (R37.1 U39.5), 13.GPIO扩展接口 (H3.8)
VCC_12V: 2.电源 (19 pins), 6.音频_FAN_ADC_LED (R131.1 R341.1 R347.1), 9.PCIE3 (8 pins), 10.PCIE2 (C249.1 C250.1 U17.3), 12.SATA接口 (5 pins)
CAM0_nRST: 11.MIPI DSI_CSI (J1.22), 13.GPIO扩展接口 (U4.5)
CAM0_PWDN: 11.MIPI DSI_CSI (J1.15), 13.GPIO扩展接口 (U4.4)
CTP0_INT: 1.BTB (BTB_3.4), 11.MIPI DSI_CSI (J14.11 R301.2)
CTP0_RST: 11.MIPI DSI_CSI (J14.12 R303.2), 13.GPIO扩展接口 (U4.17)
EARPHONE_CTL: 1.BTB (BTB_3.15), 6.音频_FAN_ADC_LED (R326.2)
FAN_CTRL: 1.BTB (BTB_3.35), 6.音频_FAN_ADC_LED (R133.1)
FUSB302_INT: 1.BTB (BTB_1.53), 5.USB3 (R87.2 U5.5)
GMAC0_MCLKINOUT: 1.BTB (BTB_1.63), 4.以太网_eth1 (R67.1 R68.1)
GMAC0_MDC: 1.BTB (BTB_1.55), 4.以太网_eth1 (R61.2 U3.13)
GMAC0_MDIO: 1.BTB (BTB_1.54), 4.以太网_eth1 (R62.2 U3.14)
GMAC0_RSTn: 1.BTB (BTB_1.46), 4.以太网_eth1 (D7.1)
GMAC0_RXCLK: 1.BTB (BTB_1.38), 4.以太网_eth1 (R56.1 R59.1)
GMAC0_RXD0: 1.BTB (BTB_1.40), 4.以太网_eth1 (R48.2 R51.1)
GMAC0_RXD1: 1.BTB (BTB_1.39), 4.以太网_eth1 (R49.2 R52.1)
GMAC0_RXD2: 1.BTB (BTB_1.42), 4.以太网_eth1 (R54.1 R58.1)
GMAC0_RXD3: 1.BTB (BTB_1.41), 4.以太网_eth1 (R50.2 R55.1)
GMAC0_RXDV_CRS: 1.BTB (BTB_1.37), 4.以太网_eth1 (R57.1 R60.1)
GMAC0_TXCLK: 1.BTB (BTB_1.61), 4.以太网_eth1 (U3.20)
GMAC0_TXD0: 1.BTB (BTB_1.59), 4.以太网_eth1 (U3.18)
GMAC0_TXD1: 1.BTB (BTB_1.60), 4.以太网_eth1 (U3.17)
GMAC0_TXD2: 1.BTB (BTB_1.57), 4.以太网_eth1 (U3.16)
GMAC0_TXD3: 1.BTB (BTB_1.58), 4.以太网_eth1 (U3.15)
GMAC0_TXEN: 1.BTB (BTB_1.62), 4.以太网_eth1 (U3.19)
GPIO0_A0: 1.BTB (BTB_3.3), 6.音频_FAN_ADC_LED (R120.2)
GPIO0_B2: 1.BTB (BTB_3.19), 3.DEBUG_SD卡_RTC_按键 (R277.2)
GPIO0_B7: 1.BTB (BTB_3.18), 10.PCIE2 (R140.2)
GPIO0_C6: 1.BTB (BTB_3.16), 10.PCIE2 (R146.2)
GPIO1_A2: 1.BTB (BTB_3.55), 11.MIPI DSI_CSI (J14.13)
GPIO1_A4: 1.BTB (BTB_3.54), 7.HDMI2 (R169.1)
GPIO1_A7: 1.BTB (BTB_3.46), 8.HDMI2 (R190.1)
GPIO1_B0: 1.BTB (BTB_3.42), 5.USB3 (R92.2)
GPIO1_B1: 1.BTB (BTB_3.47), 5.USB3 (R94.2)
GPIO1_C0: 1.BTB (BTB_3.32), 11.MIPI DSI_CSI (R306.1)
GPIO1_C1: 1.BTB (BTB_3.30), 13.GPIO扩展接口 (R199.1)
GPIO1_C6: 1.BTB (BTB_3.39), 6.音频_FAN_ADC_LED (R334.1)
GPIO1_D3: 1.BTB (BTB_3.40), 12.SATA接口 (R318.2 R320.1)
GPIO1_D5: 1.BTB (BTB_3.29), 13.GPIO扩展接口 (R40.2)
GPIO2_C5: 1.BTB (BTB_3.8), 9.PCIE3 (R221.2)
GPIO3_A6: 1.BTB (BTB_2.89), 13.GPIO扩展接口 (R35.1)
GPIO3_D5: 1.BTB (BTB_3.5), 6.音频_FAN_ADC_LED (R345.1 R351.1)
GPIO4_A3: 1.BTB (BTB_2.81), 5.USB3 (R93.1)
GPIO4_B1: 1.BTB (BTB_2.65), 9.PCIE3 (R137.1)
GPIO4_C6: 1.BTB (BTB_1.65), 9.PCIE3 (R251.2 R256.1)
HDMI_TX0_CEC_M0: 1.BTB (BTB_2.66), 7.HDMI2 (Q14.2 R170.2)
HDMI_TX0_D0N: 1.BTB (BTB_4.37), 7.HDMI2 (C136.1)
HDMI_TX0_D0P: 1.BTB (BTB_4.36), 7.HDMI2 (C135.1)
HDMI_TX0_D1N: 1.BTB (BTB_4.35), 7.HDMI2 (C134.1)
HDMI_TX0_D1P: 1.BTB (BTB_4.34), 7.HDMI2 (C133.1)
HDMI_TX0_D2N: 1.BTB (BTB_4.33), 7.HDMI2 (C132.1)
HDMI_TX0_D2P: 1.BTB (BTB_4.32), 7.HDMI2 (C131.1)
HDMI_TX0_D3N: 1.BTB (BTB_4.39), 7.HDMI2 (C138.1)
HDMI_TX0_D3P: 1.BTB (BTB_4.38), 7.HDMI2 (C137.1)
HDMI_TX0_HPD_M0: 1.BTB (BTB_3.56), 7.HDMI2 (Q8.3 R157.2)
HDMI_TX0_SBDN: 1.BTB (BTB_4.42), 7.HDMI2 (C140.1)
HDMI_TX0_SBDP: 1.BTB (BTB_4.41), 7.HDMI2 (C139.1)
HDMI_TX0_SCL_M0: 1.BTB (BTB_2.79), 7.HDMI2 (Q6.2 R151.2)
HDMI_TX0_SDA_M0: 1.BTB (BTB_2.88), 7.HDMI2 (C142.2 Q7.2 R154.2)
HDMI_TX1_CEC_M0: 1.BTB (BTB_3.7), 8.HDMI2 (Q23.2 R191.2)
HDMI_TX1_D0N: 1.BTB (BTB_4.25), 8.HDMI2 (C148.1)
HDMI_TX1_D0P: 1.BTB (BTB_4.24), 8.HDMI2 (C147.1)
HDMI_TX1_D1N: 1.BTB (BTB_4.23), 8.HDMI2 (C146.1)
HDMI_TX1_D1P: 1.BTB (BTB_4.22), 8.HDMI2 (C145.1)
HDMI_TX1_D2N: 1.BTB (BTB_4.21), 8.HDMI2 (C144.1)
HDMI_TX1_D2P: 1.BTB (BTB_4.20), 8.HDMI2 (C143.1)
HDMI_TX1_D3N: 1.BTB (BTB_4.27), 8.HDMI2 (C150.1)
HDMI_TX1_D3P: 1.BTB (BTB_4.26), 8.HDMI2 (C149.1)
HDMI_TX1_HPD_M0: 1.BTB (BTB_3.48), 8.HDMI2 (Q17.3 R178.2)
HDMI_TX1_SBDN: 1.BTB (BTB_4.30), 8.HDMI2 (C152.1)
HDMI_TX1_SBDP: 1.BTB (BTB_4.29), 8.HDMI2 (C151.1)
HDMI_TX1_SCL_M0: 1.BTB (BTB_1.45), 8.HDMI2 (Q15.2 R172.2)
HDMI_TX1_SDA_M0: 1.BTB (BTB_1.44), 8.HDMI2 (C154.2 Q16.2 R175.2)
HP_BUTTON_DET: 1.BTB (BTB_4.86), 6.音频_FAN_ADC_LED (C121.1 R116.2 R118.1)
I2C0_SCL_M2: 1.BTB (BTB_1.47), 3.DEBUG_SD卡_RTC_按键 (U35.6), 11.MIPI DSI_CSI (J1.6), 13.GPIO扩展接口 (U4.22)
I2C0_SDA_M2: 1.BTB (BTB_3.12), 3.DEBUG_SD卡_RTC_按键 (U35.5), 11.MIPI DSI_CSI (J1.5), 13.GPIO扩展接口 (U4.23)
I2C1_SCL_M2: 1.BTB (BTB_3.13), 5.USB3 (U5.6)
I2C1_SDA_M2: 1.BTB (BTB_3.11), 5.USB3 (U5.7)
I2C2_SCL_M4: 1.BTB (BTB_3.53 R26.2), 11.MIPI DSI_CSI (J14.9)
I2C2_SDA_M4: 1.BTB (BTB_3.52 R25.2), 11.MIPI DSI_CSI (J14.10)
I2C5_SCL_M3: 1.BTB (BTB_3.24 R27.2), 13.GPIO扩展接口 (R111.2)
I2C5_SDA_M3: 1.BTB (BTB_3.44 R28.2), 13.GPIO扩展接口 (R194.2)
I2C7_SCL_M0: 1.BTB (BTB_3.23 R29.2), 6.音频_FAN_ADC_LED (U16.28)
I2C7_SDA_M0: 1.BTB (BTB_3.31 R30.2), 6.音频_FAN_ADC_LED (U16.27)
I2C8_SCL_M2: 1.BTB (BTB_3.21 R31.2), 13.GPIO扩展接口 (R110.1)
I2C8_SDA_M2: 1.BTB (BTB_3.22 R32.2), 13.GPIO扩展接口 (R193.1)
I2S0_LRCK: 1.BTB (BTB_3.38), 6.音频_FAN_ADC_LED (U16.7)
I2S0_MCLK: 1.BTB (BTB_3.34), 6.音频_FAN_ADC_LED (U16.1)
I2S0_SCLK: 1.BTB (BTB_3.36), 6.音频_FAN_ADC_LED (U16.5)
I2S0_SDI0: 1.BTB (BTB_3.41), 6.音频_FAN_ADC_LED (U16.8)
I2S0_SDO0: 1.BTB (BTB_3.37), 6.音频_FAN_ADC_LED (U16.6)
LCD0_RST: 11.MIPI DSI_CSI (J14.15), 13.GPIO扩展接口 (U4.18)
MIPI_DPHY0_RX_CLKN: 1.BTB (BTB_2.13), 11.MIPI DSI_CSI (J1.10)
MIPI_DPHY0_RX_CLKP: 1.BTB (BTB_2.12), 11.MIPI DSI_CSI (J1.9)
MIPI_DPHY0_RX_D0N: 1.BTB (BTB_2.17), 11.MIPI DSI_CSI (J1.12)
MIPI_DPHY0_RX_D0P: 1.BTB (BTB_2.18), 11.MIPI DSI_CSI (J1.11)
MIPI_DPHY0_RX_D1N: 1.BTB (BTB_2.15), 11.MIPI DSI_CSI (J1.8)
MIPI_DPHY0_RX_D1P: 1.BTB (BTB_2.16), 11.MIPI DSI_CSI (J1.7)
MIPI_DPHY0_RX_D2N: 1.BTB (BTB_2.10), 11.MIPI DSI_CSI (J1.17)
MIPI_DPHY0_RX_D2P: 1.BTB (BTB_2.9), 11.MIPI DSI_CSI (J1.16)
MIPI_DPHY0_RX_D3N: 1.BTB (BTB_2.8), 11.MIPI DSI_CSI (J1.20)
MIPI_DPHY0_RX_D3P: 1.BTB (BTB_2.7), 11.MIPI DSI_CSI (J1.19)
MIPI_DPHY0_TX_CLKN: 1.BTB (BTB_2.25), 11.MIPI DSI_CSI (J14.24)
MIPI_DPHY0_TX_CLKP: 1.BTB (BTB_2.26), 11.MIPI DSI_CSI (J14.23)
MIPI_DPHY0_TX_D0N: 1.BTB (BTB_2.30), 11.MIPI DSI_CSI (J14.27)
MIPI_DPHY0_TX_D0P: 1.BTB (BTB_2.31), 11.MIPI DSI_CSI (J14.26)
MIPI_DPHY0_TX_D1N: 1.BTB (BTB_2.28), 11.MIPI DSI_CSI (J14.21)
MIPI_DPHY0_TX_D1P: 1.BTB (BTB_2.29), 11.MIPI DSI_CSI (J14.20)
MIPI_DPHY0_TX_D2N: 1.BTB (BTB_2.22), 11.MIPI DSI_CSI (J14.18)
MIPI_DPHY0_TX_D2P: 1.BTB (BTB_2.23), 11.MIPI DSI_CSI (J14.17)
MIPI_DPHY0_TX_D3N: 1.BTB (BTB_2.20), 11.MIPI DSI_CSI (J14.30)
MIPI_DPHY0_TX_D3P: 1.BTB (BTB_2.21), 11.MIPI DSI_CSI (J14.29)
PCIE20_0_RXN: 1.BTB (BTB_3.98), 12.SATA接口 (C297.1)
PCIE20_0_RXP: 1.BTB (BTB_3.97), 12.SATA接口 (C298.1)
PCIE20_0_TXN: 1.BTB (BTB_3.95), 12.SATA接口 (C296.1)
PCIE20_0_TXP: 1.BTB (BTB_3.96), 12.SATA接口 (C295.1)
PCIE20_1_REFCLKN: 1.BTB (BTB_3.85), 10.PCIE2 (J13.49)
PCIE20_1_REFCLKP: 1.BTB (BTB_3.84), 10.PCIE2 (J13.47)
PCIE20_1_RXN: 1.BTB (BTB_3.88), 10.PCIE2 (J13.43)
PCIE20_1_RXP: 1.BTB (BTB_3.87), 10.PCIE2 (J13.41)
PCIE20_1_TXN: 1.BTB (BTB_3.90), 10.PCIE2 (C252.1)
PCIE20_1_TXP: 1.BTB (BTB_3.89), 10.PCIE2 (C251.1)
PCIE30_PORT0_REF_CLKN: 1.BTB (BTB_3.77), 9.PCIE3 (R217.2 R219.1)
PCIE30_PORT0_REF_CLKP: 1.BTB (BTB_3.76), 9.PCIE3 (R216.2 R220.1)
PCIE30_PORT0_RX0N: 1.BTB (BTB_3.82), 9.PCIE3 (J19.41)
PCIE30_PORT0_RX0P: 1.BTB (BTB_3.81), 9.PCIE3 (J19.43)
PCIE30_PORT0_RX1N: 1.BTB (BTB_3.80), 9.PCIE3 (J19.29)
PCIE30_PORT0_RX1P: 1.BTB (BTB_3.79), 9.PCIE3 (J19.31)
PCIE30_PORT0_TX0N: 1.BTB (BTB_3.74), 9.PCIE3 (C177.1)
PCIE30_PORT0_TX0P: 1.BTB (BTB_3.73), 9.PCIE3 (C178.1)
PCIE30_PORT0_TX1N: 1.BTB (BTB_3.72), 9.PCIE3 (C175.1)
PCIE30_PORT0_TX1P: 1.BTB (BTB_3.71), 9.PCIE3 (C176.1)
PCIE30_PORT1_REF_CLKN: 1.BTB (BTB_3.59), 9.PCIE3 (R243.2 R244.1)
PCIE30_PORT1_REF_CLKP: 1.BTB (BTB_3.60), 9.PCIE3 (R242.2 R245.1)
PCIE30_PORT1_RX0N: 1.BTB (BTB_3.69), 9.PCIE3 (J20.A17)
PCIE30_PORT1_RX0P: 1.BTB (BTB_3.68), 9.PCIE3 (J20.A16)
PCIE30_PORT1_RX1N: 1.BTB (BTB_3.67), 9.PCIE3 (J20.A22)
PCIE30_PORT1_RX1P: 1.BTB (BTB_3.66), 9.PCIE3 (J20.A21)
PCIE30_PORT1_TX0N: 1.BTB (BTB_3.65), 9.PCIE3 (C190.1)
PCIE30_PORT1_TX0P: 1.BTB (BTB_3.64), 9.PCIE3 (C189.1)
PCIE30_PORT1_TX1N: 1.BTB (BTB_3.63), 9.PCIE3 (C192.1)
PCIE30_PORT1_TX1P: 1.BTB (BTB_3.62), 9.PCIE3 (C191.1)
PCIE30X1_0_CLKREQN_M0: 1.BTB (BTB_1.49), 10.PCIE2 (R145.1)
PCIE30X1_0_PERSTN_M0: 1.BTB (BTB_3.27), 10.PCIE2 (R144.2)
PCIE30X1_0_WAKEN_M0: 1.BTB (BTB_3.17), 10.PCIE2 (R148.1)
PCIE30X2_CLKREQN_M1: 1.BTB (BTB_2.73), 9.PCIE3 (R248.1)
PCIE30X2_PERSTN_M1: 1.BTB (BTB_2.75), 9.PCIE3 (J20.A11)
PCIE30X2_WAKEN_M1: 1.BTB (BTB_2.74), 9.PCIE3 (R247.1)
PCIE30X4_CLKREQN_M1: 1.BTB (BTB_2.72), 9.PCIE3 (J19.52)
PCIE30X4_PERSTN_M1: 1.BTB (BTB_2.77), 9.PCIE3 (J19.50)
PCIE30X4_WAKEN_M1: 1.BTB (BTB_2.84), 9.PCIE3 (J19.54)
PWR_ON: 1.BTB (BTB_1.84), 3.DEBUG_SD卡_RTC_按键 (R19.2)
RECOVERY_KEY: 1.BTB (BTB_4.84), 3.DEBUG_SD卡_RTC_按键 (R2.2)
RESETn: 1.BTB (BTB_1.85), 3.DEBUG_SD卡_RTC_按键 (R5.2)
RTC_INT: 1.BTB (BTB_3.28), 3.DEBUG_SD卡_RTC_按键 (R3.2 U35.3)
SARADC_IN0_BOOT: 1.BTB (BTB_4.85), 3.DEBUG_SD卡_RTC_按键 (R1.2)
SDMMC_CLK: 1.BTB (BTB_4.49), 3.DEBUG_SD卡_RTC_按键 (R280.1)
SDMMC_CMD: 1.BTB (BTB_4.46), 3.DEBUG_SD卡_RTC_按键 (R279.1)
SDMMC_D0: 1.BTB (BTB_4.47), 3.DEBUG_SD卡_RTC_按键 (R281.1)
SDMMC_D1: 1.BTB (BTB_4.48), 3.DEBUG_SD卡_RTC_按键 (R282.1)
SDMMC_D2: 1.BTB (BTB_4.44), 3.DEBUG_SD卡_RTC_按键 (R275.1)
SDMMC_D3: 1.BTB (BTB_4.45), 3.DEBUG_SD卡_RTC_按键 (R278.1)
SDMMC_DET: 1.BTB (BTB_3.26), 3.DEBUG_SD卡_RTC_按键 (R283.1 R284.2)
TYPEC0_SBU1: 1.BTB (BTB_4.81), 5.USB3 (C84.2)
TYPEC0_SBU2: 1.BTB (BTB_4.82), 5.USB3 (C85.2)
TYPEC0_SSRX1N: 1.BTB (BTB_4.7), 5.USB3 (R86.2)
TYPEC0_SSRX1P: 1.BTB (BTB_4.8), 5.USB3 (R85.2)
TYPEC0_SSRX2N: 1.BTB (BTB_2.48), 5.USB3 (R91.2)
TYPEC0_SSRX2P: 1.BTB (BTB_2.49), 5.USB3 (R89.2)
TYPEC0_SSTX1N: 1.BTB (BTB_4.6), 5.USB3 (C80.2)
TYPEC0_SSTX1P: 1.BTB (BTB_4.5), 5.USB3 (C79.2)
TYPEC0_SSTX2N: 1.BTB (BTB_2.47), 5.USB3 (C83.2)
TYPEC0_SSTX2P: 1.BTB (BTB_2.46), 5.USB3 (C82.2)
TYPEC0_USB20_OTG_DM: 1.BTB (BTB_4.77), 5.USB3 (R82.2)
TYPEC0_USB20_OTG_DP: 1.BTB (BTB_4.76), 5.USB3 (R81.2)
TYPEC0_USB20_OTG_ID: 1.BTB (BTB_4.79), 5.USB3 (R78.2)
TYPEC0_USB20_VBUSDET: 1.BTB (BTB_4.80), 5.USB3 (R77.2)
TYPEC1_SSRX1N: 1.BTB (BTB_4.18), 5.USB3 (R83.2)
TYPEC1_SSRX1P: 1.BTB (BTB_4.17), 5.USB3 (R84.2)
TYPEC1_SSTX1N: 1.BTB (BTB_4.15), 5.USB3 (C75.2)
TYPEC1_SSTX1P: 1.BTB (BTB_4.16), 5.USB3 (C76.2)
TYPEC1_USB20_OTG_DM: 1.BTB (BTB_4.70), 5.USB3 (R79.2)
TYPEC1_USB20_OTG_DP: 1.BTB (BTB_4.69), 5.USB3 (R80.2)
TYPEC1_USB20_VBUSDET: 1.BTB (BTB_4.67), 5.USB3 (C253.1 R149.1 R150.2)
UART2_RX_M0_DEBUG: 1.BTB (BTB_1.48), 3.DEBUG_SD卡_RTC_按键 (U34.4)
UART2_TX_M0_DEBUG: 1.BTB (BTB_3.20), 3.DEBUG_SD卡_RTC_按键 (U33.2)
UART4_RX_M2: 1.BTB (BTB_3.45), 13.GPIO扩展接口 (R197.1)
UART4_TX_M2: 1.BTB (BTB_3.43), 13.GPIO扩展接口 (R195.1)
UART7_RX_M2: 1.BTB (BTB_3.25), 13.GPIO扩展接口 (R198.2)
UART7_TX_M2: 1.BTB (BTB_3.49), 13.GPIO扩展接口 (R196.2)
USB20_HOST0_DM: 1.BTB (BTB_4.62), 5.USB3 (R88.2)
USB20_HOST0_DP: 1.BTB (BTB_4.61), 5.USB3 (R90.2)
USB20_HOST1_DM: 1.BTB (BTB_4.65), 10.PCIE2 (R143.1)
USB20_HOST1_DP: 1.BTB (BTB_4.64), 10.PCIE2 (R142.1)
USB20_HOST_PWR_EN: 5.USB3 (R324.1), 13.GPIO扩展接口 (R39.2)
USB30_OTG_PWR_EN: 5.USB3 (R96.1), 13.GPIO扩展接口 (R38.2)